# Altium project Emitter.PrjPcb
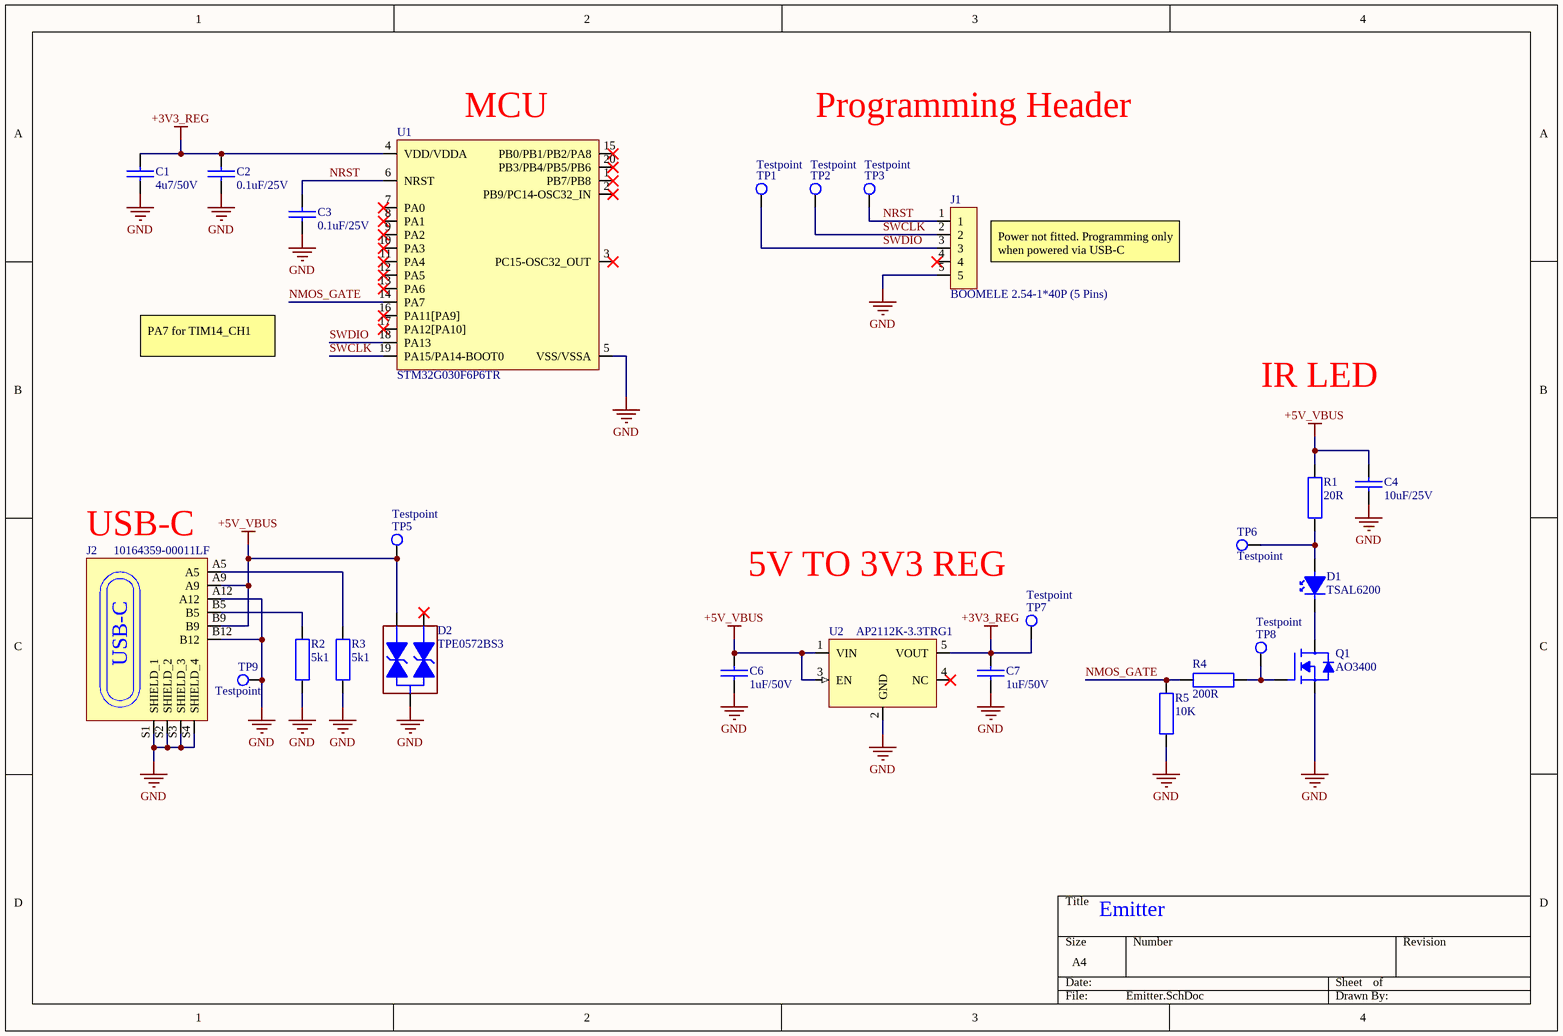
[diagram p0: Emitter.SchDoc]
1 sheet, 26 parts. Net scope: global (net labels, ports and power ports of the same name join across sheets).
Board file: Emitter.PcbDoc

## Sheet Emitter.SchDoc
size A4; SheetNumber: 1; SheetTotal: 1

### Parts
C1  4u7/50V  [CAPC2012X95N]
C2  0.1uF/25V  [CAPC2012X95N]
C3  0.1uF/25V  [CAPC2012X95N]
C4  10uF/25V  [CAPC2012X95N]
C6  1uF/50V  [CAPC2012X95N]
C7  1uF/50V  [CAPC2012X95N]
D1  TSAL6200  [TSAL6200]
D2  TPE0572BS3  [SOT95P240X115-3N]
J1  BOOMELE 2.54-1*40P (5 Pins)  [HDRV_1X05_P254]
J2  10164359-00011LF  [10164359-00011LF]
Q1  AO3400  [SOT95P240X115-3N]
R1  20R  [RESC3116X65N]
R2  5k1  [RESC2012X60N]
R3  5k1  [RESC2012X60N]
R4  200R  [RESC2012X60N]
R5  10K  [RESC2012X60N]
TP1  Testpoint  [TP_SMD_R1M0]
TP2  Testpoint  [TP_SMD_R1M0]
TP3  Testpoint  [TP_SMD_R1M0]
TP5  Testpoint  [TP_SMD_R1M0]
TP6  Testpoint  [TP_SMD_R1M0]
TP7  Testpoint  [TP_SMD_R1M0]
TP8  Testpoint  [TP_SMD_R1M0]
TP9  Testpoint  [TP_SMD_R1M0]
U1  STM32G030F6P6TR  [TSOP65P640X120-20N]
U2  AP2112K-3.3TRG1  [SOT95P285X140-5N]

### Nets
+3V3_REG: C1.2 C2.2 C7.2 TP7.1 U1.4(VDD/VDDA) U2.5(VOUT)
+5V_VBUS: C4.2 C6.2 D2.2 J2.A9 J2.B9 R1.2 TP5.1 U2.1(VIN) U2.3(EN)
GND: C1.1 C2.1 C3.1 C4.1 C6.1 C7.1 D2.3(GND) J1.5 J2.A12 J2.B12 J2.S1(SHIELD_1) J2.S2(SHIELD_2) J2.S3(SHIELD_3) J2.S4(SHIELD_4) Q1.2 R2.1 R3.1 R5.1 TP9.1 U1.5(VSS/VSSA) U2.2(GND)
NMOS_GATE: R4.1 R5.2 U1.14(PA7)
NRST: C3.2 J1.1 TP3.1 U1.6(NRST)
SWCLK: J1.2 TP2.1 U1.19(PA15/PA14-BOOT0)
SWDIO: J1.3 TP1.1 U1.18(PA13)
NetD1_1: D1.1 Q1.3
NetD1_2: D1.2 R1.1 TP6.1
NetJ2_A5: J2.A5 R3.2
NetJ2_B5: J2.B5 R2.2
NetQ1_1: Q1.1 R4.2 TP8.1

Not connected (* = marked no-connect by the designer): D2 1*; J1 4*; U1 1(PB7/PB8)* 2(PB9/PC14-OSC32_IN)* 3(PC15-OSC32_OUT)* 7(PA0)* 8(PA1)* 9(PA2)* 10(PA3)* 11(PA4)* 12(PA5)* 13(PA6)* 15(PB0/PB1/PB2/PA8)* 16(PA11[PA9])* 17(PA12[PA10])* 20(PB3/PB4/PB5/PB6)*; U2 4(NC)*

### Notes on the sheet
- (near U1) MCU
- Programming Header
- (near J1) Power not fitted. Programming only when powered via USB-C
- PA7 for TIM14_CH1
- IR LED
- (near J2) USB-C
- 5V TO 3V3 REG
- Emitter
- (in symbol 10164359-00011LF) USB-C

### Library data of the parts
C1 = CL21A475KBQNNNE: CAP CER 4.7uF 50V X5R 0805; Manufacturer: Samsung Electro-Mechanics; Manufacturer Part Number: CL21A475KBQNNNE; ComponentLink1Description: Datasheet; ComponentLink1URL: https://mm.digikey.com/Volume0/opasdata/d220001/medias/docus/5727/CL21A475KBQNNNE.pdf
C2 C3 = CC0805KRX7R8BB104: CAP CER 0.1UF 25V X7R 0805; Manufacturer: Yageo; Manufacturer Part Number: CC0805KRX7R8BB104; ComponentLink1Description: Datasheet; ComponentLink1URL: https://yageogroup.com/content/datasheet/asset/file/UPY-GPHC_X7R_6_3V-TO-250V
C4 = CL21B106KAYQNNE: CAP CER 10uF 25V X7R 0805; Manufacturer: Samsung Electro-Mechanics; Manufacturer Part Number: CL21B106KAYQNNE; ComponentLink1Description: Datasheet; ComponentLink1URL: https://mm.digikey.com/Volume0/opasdata/d220001/medias/docus/7851/1276_CL21B1.pdf; LCSC Part Number: C3039694
C6 C7 = CC0805KKX7R9BB105: CAP CER 1UF 50V X7R 0805; Manufacturer: Yageo; Manufacturer Part Number: CC0805KKX7R9BB105; ComponentLink1Description: Datasheet; ComponentLink1URL: https://yageogroup.com/content/datasheet/asset/file/UPY-GPHC_X7R_6_3V-TO-250V; LCSC Part Number: C91185
D1 = TSAL6200: Infrared (IR) Emitter 940nm 1.35V 100mA 40mW/sr @ 100mA 34° Radial, 5mm Dia (T 1 3/4); Manufacturer: Vishay; 3D Model Source: Ultra Librarian; Manufacturer Part Number: TSAL6200; ComponentLink1Description: Datasheet; ComponentLink1URL: https://www.vishay.com/docs/81011/tsal6400.pdf
D2 = TPE0572BS3: ESD DIODE 5VWM 6VC 10VC SOT-23; Manufacturer: TECH PUBLIC; Manufacturer Part Number: TPE0572BS3; ComponentLink1Description: Datasheet; ComponentLink1URL: https://www.lcsc.com/datasheet/C2858713.pdf?spm=wm.sxq.inf.ggs___wm.fly.bg.11.xh&lcsc_vid=QABaAgJWE1YLVVZSTlReAQUDElVWAgYAFlMMUQAAQlMxVlNeRlNYXlRVRFhZVDsOAxUeFF5JWBYZEEoKFBINSQcJGk4NBhADEA4cHktRR1NADxALGw%3D%3D; LCSC Part Number: C2858713
J1 = BOOMELE 2.54-1*40P (5 Pins Only): CONN HEADER 40POS 2.54mm SINGLE ROW TH (5 Pins Only); Manufacturer: Boom Precision Electronics; Manufacturer Part Number: 2.54-1*40P; ComponentLink1Description: Datasheet; ComponentLink1URL: https://www.lcsc.com/datasheet/C2337.pdf?spm=wm.sxq.inf.ggs&lcsc_vid=E1AKUgZVRlYMBVwCQFNcVFIETwAMX1xfTlRWVwFeRlQxVlNeRlBXVVJQT1hdXjsOAxUeFF5JWBYZEEoKFBINSQcJGk4NBhADEA4cHktRTlNADxALGw%3D%3D; LCSC Part Number: C2337; ComponentLink2Description: 3D Model Source; ComponentLink2URL: https://www.snapeda.com/parts/61300511121/Wurth%20Electronics/view-part/
J2 = 10164359-00011LF: USB-C Receptacle Connector 24 (6+18 Dummy) - Power Only 6 Pin Position Surface Mount, Right Angle; Through Hole; Manufacturer: Amphenol ICC (FCI); Manufacturer Part Number: 10164359-00011LF; ComponentLink1Description: Datasheet; ComponentLink1URL: https://cdn.amphenol-cs.com/media/wysiwyg/files/drawing/10164359.pdf; ComponentLink2Description: 3D Model Source; ComponentLink2URL: https://www.snapeda.com/parts/10164359-00011LF/Amphenol/view-part/
Q1 = AO3400: MOSFET N-CH 30V 5.8A SOT-23; Manufacturer: Guangdong Hottech; Manufacturer Part Number: AO3400; ComponentLink1Description: Datasheet; ComponentLink1URL: https://www.lcsc.com/datasheet/C181090.pdf?spm=wm.sxq.inf.ggs___wm.ssy.em.0.tz&lcsc_vid=E1AKUgZVRlYMBVwCQFNcVFIETwAMX1xfTlRWVwFeRlQxVlNeRlBWUVNfR1VfVzsOAxUeFF5JWBYZEEoKFBINSQcJGk4eFQsCAgIaSgADAwAHC0slRlJZU1NeWQkaCgg%3D; LCSC Part Number: C181090
R1 = RC1206FR-0720RL: RES 20 OHM 1% 1/4W 1206; Manufacturer: Yageo; Manufacturer Part Number: RC1206FR-0720RL; ComponentLink1Description: Datasheet; ComponentLink1URL: https://yageogroup.com/content/datasheet/asset/file/PYU-RC_GROUP_51_ROHS_L; LCSC Part Number: C114941
R2 R3 = RC0805FR-075K1L: RES 5.1K OHM 1% 1/8W 0805; Manufacturer: Yageo; Manufacturer Part Number: RC0805FR-075K1L; ComponentLink1Description: Datasheet; ComponentLink1URL: https://yageogroup.com/content/datasheet/asset/file/PYU-RC_GROUP_51_ROHS_L; LCSC Part Number: C84375
R4 = RC0805FR-07200RL: RES 200Ω ±1% 125mW 0805; Manufacturer: Yageo; Manufacturer Part Number: RC0805FR-07200RL; ComponentLink1Description: Datasheet; ComponentLink1URL: https://yageogroup.com/content/datasheet/asset/file/PYU-RC_GROUP_51_ROHS_L
R5 = RT0805BRD0710KL: RES SMD 10K OHM 0.1% 1/8W 0805; Manufacturer: Yageo; Manufacturer Part Number: RT0805BRD0710KL; ComponentLink1Description: Datasheet; ComponentLink1URL: https://yageogroup.com/content/datasheet/asset/file/PYU-RT_1-TO-0-01_ROHS_L
U1 = STM32G030F6P6TR: IC MCU 32BIT 32KB FLASH 20TSSOP; Manufacturer: STMicroelectronics; Manufacturer Part Number: STM32G030F6P6TR; ComponentLink1Description: Datasheet; ComponentLink1URL: https://www.st.com/resource/en/datasheet/stm32g030f6.pdf
U2 = AP2112K-3.3TRG1: IC REG LINEAR 3.3V 600MA SOT-25; Manufacturer: Diodes Incorporated; Manufacturer Part Number: AP2112K-3.3TRG1; ComponentLink1Description: Datasheet; ComponentLink1URL: https://www.diodes.com/assets/Datasheets/AP2112.pdf; LCSC Part Number: C51118